# EAGLE design HLM1_Outsourced (EAGLE 8.4.1)
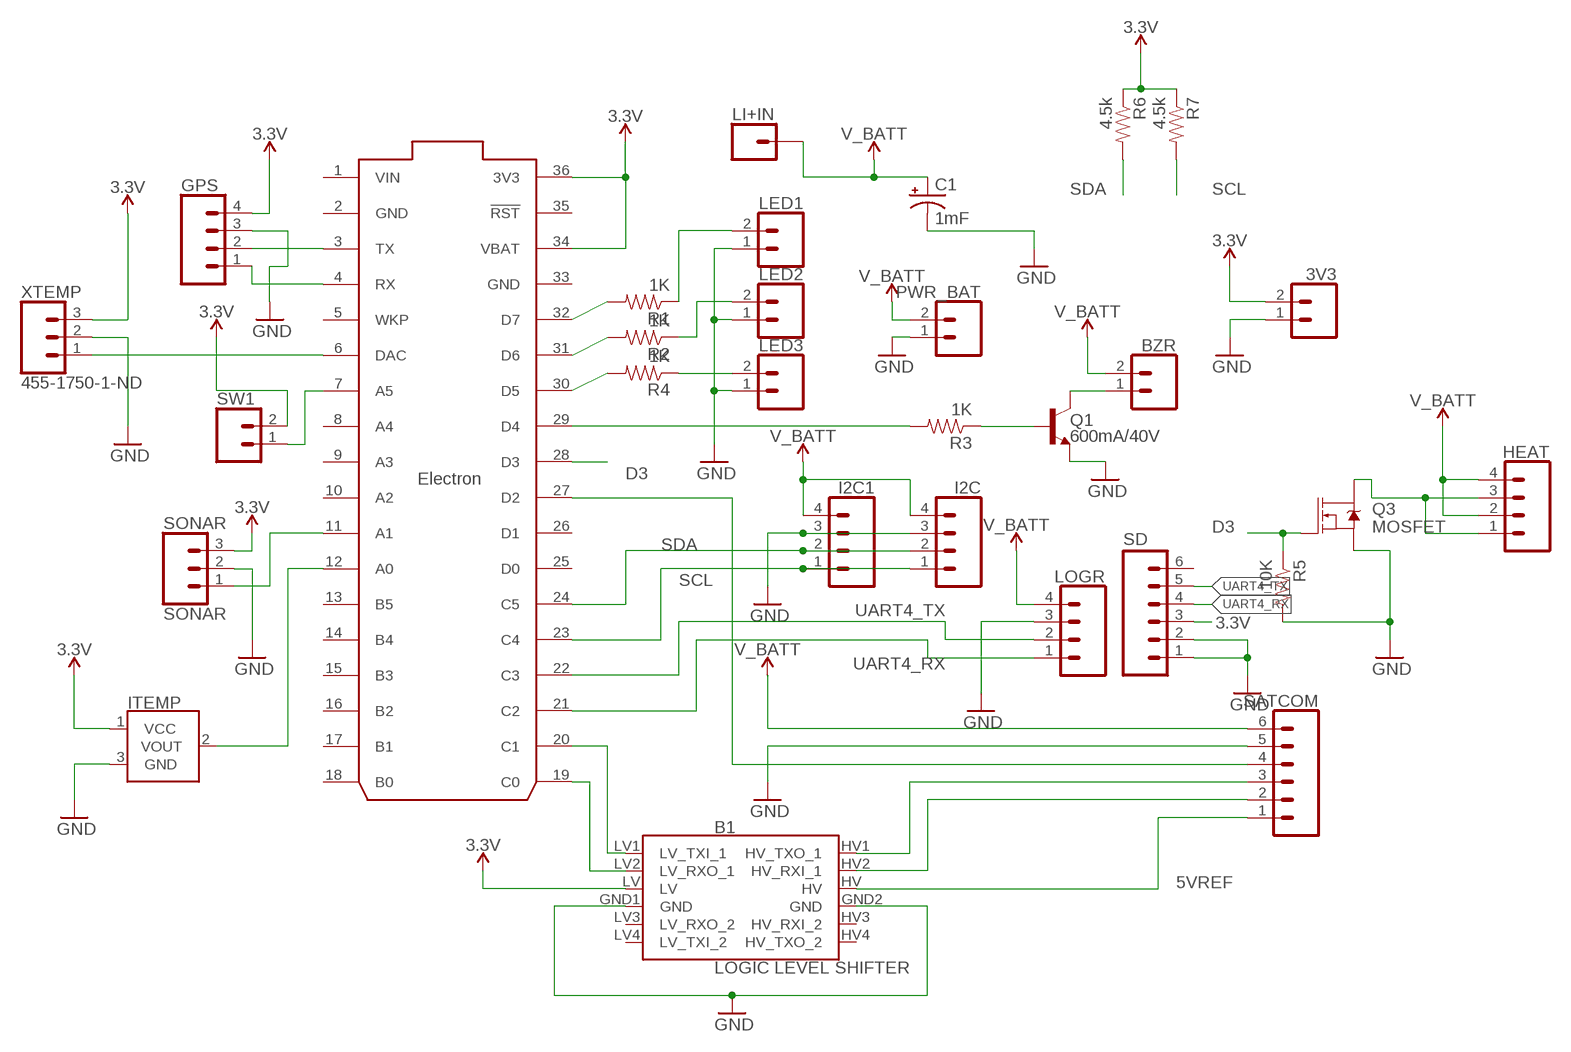
[diagram p0: schematic, sheet 1]

## Parts
3V3  CONN_02  [1X02]
B1  LOGIC LEVEL SHIFTER  SPARKFUN_LOGIC_LEVEL_CONVERTER  [SPARKFUN_LOGIC_LEVEL_CONVERTER]
BZR  CONN_02  [1X02]
C1  1mF  1000UF-RADIAL-5MM-25V-20%  [CPOL-RADIAL-5MM-10MM]
GPS  CONN_04  [1X04]
HEAT  CONN_04  [1X04]
I2C  CONN_04  [1X04]
I2C1  CONN_04  [1X04]
ITEMP  TMP36GT9  [TO-92]
LED1  CONN_02  [1X02]
LED2  CONN_02  [1X02]
LED3  CONN_02  [1X02]
LI+IN  CONN_01  [1X01]
LOGR  CONN_04  [1X04]
MCU  ELECTRON  ELECTRON_WITH_HEADERS  [ELECTRON]
PWR_BAT  CONN_02  [1X02]
Q1  600mA/40V  TRANS_NPN-P2N2222A  [TO-92]
Q3  MOSFET  MOSFET-NCH-FQP30N06L  [TO220V]
R1  1K  RESISTORPTH-1/6W  [1/6W-RES]
R2  1K  RESISTORPTH-1/6W  [1/6W-RES]
R3  1K  RESISTORPTH-1/6W  [1/6W-RES]
R4  1K  RESISTORPTH-1/6W  [1/6W-RES]
R5  10K  RESISTORPTH-1/6W  [1/6W-RES]
R6  4.5k  RESISTORPTH-1/6W  [1/6W-RES]
R7  4.5k  RESISTORPTH-1/6W  [1/6W-RES]
SATCOM  CONN_06SILK_FEMALE_PTH  [1X06@1]
SD  M06NO_SILK_FEMALE_PTH  [1X06_NO_SILK]
SONAR  SONAR  CONN_03  [1X03]
SW1  CONN_02  [1X02]
XTEMP  455-1750-1-ND  CONN_03  [1X03]

## Nets
3.3V: 3V3.2 B1.LV GPS.4 ITEMP.1(VCC) MCU.34(VBAT) MCU.36(3V3) R6.1 R7.1 SD.3 SONAR.3 SW1.2 XTEMP.3
5VREF: B1.HV SATCOM.1
D3: MCU.28(D3) Q3.1(G) R5.1
GND: 3V3.1 B1.GND1(GND) B1.GND2(GND) C1.- GPS.3 I2C1.3 I2C.3 ITEMP.3(GND) LED1.1 LED2.1 LED3.1 LOGR.3 PWR_BAT.1 Q1.3(E) Q3.3(S) R5.2 SATCOM.5 SD.1 SD.2 SONAR.2 XTEMP.2
IRWKP: MCU.27(D2) SATCOM.4
N$1: MCU.6(DAC) XTEMP.1
N$3: MCU.32(D7) R1.2
N$4: Q1.2(B) R3.1
N$5: MCU.29(D4) R3.2
N$6: B1.LV1(LV_TXI_1) MCU.20(C1)
N$7: B1.LV2(LV_RXO_1) MCU.19(C0)
N$8: LED1.2 R1.1
N$9: BZR.1 Q1.1(C)
N$10: B1.HV1(HV_TXO_1) SATCOM.3
N$11: HEAT.1 HEAT.3 Q3.2(D)
N$13: MCU.31(D6) R2.2
N$14: B1.HV2(HV_RXI_1) SATCOM.2
N$15: MCU.7(A5) SW1.1
N$16: LED2.2 R2.1
N$17: MCU.11(A1) SONAR.1
N$18: MCU.30(D5) R4.2
N$19: LED3.2 R4.1
N$21: ITEMP.2(VOUT) MCU.12(A0)
RX: GPS.1 MCU.4(RX)
SCL: I2C1.1 I2C.1 MCU.23(C4) R7.2
SDA: I2C1.2 I2C.2 MCU.24(C5) R6.2
TX: GPS.2 MCU.3(TX)
UART4_RX: LOGR.1 MCU.21(C2) SD.4
UART4_TX: LOGR.2 MCU.22(C3) SD.5
V_BATT: BZR.2 C1.+ HEAT.2 HEAT.4 I2C1.4 I2C.4 LI+IN.1 LOGR.4 PWR_BAT.2 SATCOM.6
Unconnected: B1.HV3(HV_RXI_2) B1.HV4(HV_TXO_2) B1.LV3(LV_RXO_2) B1.LV4(LV_TXI_2) MCU.5(WKP) MCU.8(A4) MCU.9(A3) MCU.10(A2) MCU.13(B5) MCU.14(B4) MCU.15(B3) MCU.16(B2) MCU.17(B1) MCU.18(B0) MCU.25(D0) MCU.26(D1) MCU.35(!RST) SD.6

## Power pins joined to a net without a drawn wire
GND: MCU.2(GND) MCU.33(GND)
VIN: MCU.1(VIN)

## Library data of the parts
3V3 BZR LED1-LED3 PWR_BAT SW1 = SparkFun-Connectors:CONN_02: Multi connection point. Often used as Generic Header-pin footprint for 0.1 inch spaced/style header connections On any of the 0.1 inch spaced packages, you can populate with these: Break Away Headers - Straight <https://www.sparkfun.com/products/116> (PRT-00116) Break Away Male Headers - Right Angle <https://www.sparkfun.com/products/553> (PRT-00553) Female Headers <https://www.sparkfun.com/products/115> (PRT-00115) Break Away Headers - Machine Pin <https://www.sparkfun.com/products/117> (PRT-00117) Break Away Female Headers - Swiss Machine Pin <https://www.sparkfun.com/products/743> (PRT-00743) For SCREWTERMINALS and SPRING TERMINALS visit here: Screw Terimnals on SparkFun.com <https://www.sparkfun.com/search/results?term=Screw+Terminals> (5mm/3.5mm/2.54mm spacing) This device is also useful as a general connection point to wire up your design to another part of your project. Our various solder wires solder well into these plated through hole pads. Hook-Up Wire - Assortment (Stranded, 22 AWG) <https://www.sparkfun.com/products/11375> (PRT-11375) Hook-Up Wire - Assortment (Solid Core, 22 AWG) <https://www.sparkfun.com/products/11367> (PRT-11367) View the entire wire category on our website here <https://www.sparkfun.com/categories/141> Special notes: Molex polarized connector foot print use with: PRT-08233 with associated crimp pins and housings. 2.54_SCREWTERM for use with PRT-10571. 3.5mm Screw Terminal footprints for PRT-08084 5mm Screw Terminal footprints for use with PRT-08432
B1 = SparkFun-Boards:SPARKFUN_LOGIC_LEVEL_CONVERTER: SparkFun Logic Level Converter -Bi-Directional This is the mechnical outline for the 3.3V - 5V bi directional logic level converter. *Note, the "LOCK" Package has the header pins staggered by an offset of 5 mils (off center line), so that when you slide a row of standard 0.1" headers into the PTH pads, it will hold position vertically. See the follwing turorial for more information on this type of special footprints: Sneaky Footprints <https://www.sparkfun.com/tutorials/114> SparkFun Products: SparkFun Logic Level Converter - Bi-Directional <https://www.sparkfun.com/products/12009>
C1 = SparkFun-Capacitors:1000UF: 1,000µF/1mF ceramic capacitors A capacitor is a passive two-terminal electrical component used to store electrical energy temporarily in an electric field. CAP-08070; PROD_ID: CAP-09538
GPS HEAT I2C I2C1 LOGR = SparkFun-Connectors:CONN_04: Multi connection point. Often used as Generic Header-pin footprint for 0.1 inch spaced/style header connections On any of the 0.1 inch spaced packages, you can populate with these: Break Away Headers - Straight <https://www.sparkfun.com/products/116> (PRT-00116) Break Away Male Headers - Right Angle <https://www.sparkfun.com/products/553> (PRT-00553) Female Headers <https://www.sparkfun.com/products/115> (PRT-00115) Break Away Headers - Machine Pin <https://www.sparkfun.com/products/117> (PRT-00117) Break Away Female Headers - Swiss Machine Pin <https://www.sparkfun.com/products/743> (PRT-00743) For SCREWTERMINALS and SPRING TERMINALS visit here: Screw Terimnals on SparkFun.com <https://www.sparkfun.com/search/results?term=Screw+Terminals> (5mm/3.5mm/2.54mm spacing) This device is also useful as a general connection point to wire up your design to another part of your project. Our various solder wires solder well into these plated through hole pads. Hook-Up Wire - Assortment (Stranded, 22 AWG) <https://www.sparkfun.com/products/11375> (PRT-11375) Hook-Up Wire - Assortment (Solid Core, 22 AWG) <https://www.sparkfun.com/products/11367> (PRT-11367) View the entire wire category on our website here <https://www.sparkfun.com/categories/141> Special notes: Molex polarized connector foot print use with SKU : PRT-08231 with associated crimp pins and housings. 1MM SMD Version SKU: PRT-10208; PROD_ID: CONN-09696
ITEMP = SparkFun-Sensors:TMP36: TMP36 Precision Analog °C Temperature Sensor The TMP36 is a low voltage, precision centigrade temperature sensor. It provides a voltage output that is linearly proportional to the Celsius temperature. It also doesn’t require any external calibration to provide typical accuracies of ±1°C at +25°C and ±2°C over the −40°C to +125°C temperature range. We like it because it’s so easy to use: Just give the device a ground and 2.7 to 5.5 VDC and read the voltage on the Vout pin. The output voltage can be converted to temperature easily using the scale factor of 10 mV/°C. Datasheet <http://cdn.sparkfun.com/datasheets/Sensors/Temp/TMP35_36_37.pdf> SparkFun Products Temperature Sensor - TMP36 <https://www.sparkfun.com/products/10988> (SEN-10988) SparkFun Danger Shield <https://www.sparkfun.com/products/11649> (DEV-11649); PROD_ID: IC-09880; SF_ID: SEN-10988
LI+IN = SparkFun-Connectors:CONN_01: Single connection point. Often used as Generic Header-pin footprint for 0.1 inch spaced/style header connections On any of the 0.1 inch spaced packages, you can populate with these: Break Away Headers - Straight <https://www.sparkfun.com/products/116> (PRT-00116) Break Away Male Headers - Right Angle <https://www.sparkfun.com/products/553> (PRT-00553) Female Headers <https://www.sparkfun.com/products/115> (PRT-00115) Break Away Headers - Machine Pin <https://www.sparkfun.com/products/117> (PRT-00117) Break Away Female Headers - Swiss Machine Pin <https://www.sparkfun.com/products/743> (PRT-00743) This device is also useful as a general connection point to wire up your design to another part of your project. Our various solder wires solder well into these plated through hole pads. Hook-Up Wire - Assortment (Stranded, 22 AWG) <https://www.sparkfun.com/products/11375> (PRT-11375) Hook-Up Wire - Assortment (Solid Core, 22 AWG) <https://www.sparkfun.com/products/11367> (PRT-11367) View the entire wire category on our website here <https://www.sparkfun.com/categories/141> Special notes: SMTSO-256-ET is a "flush mount" nut for a 4-40 screw. We mostly use this on specialty testbeds; it is a nice way to connect hardware to your PCB at an adjustable hieght. Also note, the SNAP packages are for using a snappable style connector. We sell a baggie of snaps and they are also used on two LilyPad designs: Snap Assortment - 30 pack (male and female) <https://www.sparkfun.com/products/11347> (DEV-11347) LilyPad Arduino SimpleSnap <https://www.sparkfun.com/products/10941> (DEV-10941) LilyPad SimpleSnap Protoboard <https://www.sparkfun.com/products/10940> (DEV-10940)
MCU = Particle-Devices:ELECTRON: Particle Electron footprint
Q1 = SparkFun-DiscreteSemi:TRANS_NPN: NPN transistor Current controlled devices typically used to amplify current or used as a switch. BC547 - COM-08928 <http://www.sparkfun.com/products/8928> (TO-92 45V 100mA) (1.Collector 2.Base 3.Emitter) 2N3904 - COM-00521 <http://www.sparkfun.com/products/521> (TO-92 40V 200mA) (1.Emitter 2.Base 3.Collector) P2N2222A - COM-12852 <http://www.sparkfun.com/products/12852> (TO-92 40V 600mA) (1.Collector 2.Base 3.Emitter); PROD_ID: TRANS-09536
Q3 = SparkFun-DiscreteSemi:MOSFET-NCH: N-channel MOSFETs Voltage controlled devices that allow control of high current outputs. SparkFun Products: SparkFun OpenScale <https://www.sparkfun.com/products/13261> SparkFun Digital Sandbox <https://www.sparkfun.com/products/12651> SparkFun Monster Moto Shield <https://www.sparkfun.com/products/10182> SparkFun MOSFET Power Controller <https://www.sparkfun.com/products/11214>; PROD_ID: TRANS-10060; VALUE: 60V/32A/35mΩ
R1-R7 = SparkFun-Passives:RESISTOR: Resistor Basic schematic elements and footprints for 0603, 1206, and PTH resistors.
SATCOM = SparkFun-Connectors:CONN_06: Multi connection point. Often used as Generic Header-pin footprint for 0.1 inch spaced/style header connections On any of the 0.1 inch spaced packages, you can populate with these: Break Away Headers - Straight <https://www.sparkfun.com/products/116> (PRT-00116) Break Away Male Headers - Right Angle <https://www.sparkfun.com/products/553> (PRT-00553) Female Headers <https://www.sparkfun.com/products/115> (PRT-00115) Break Away Headers - Machine Pin <https://www.sparkfun.com/products/117> (PRT-00117) Break Away Female Headers - Swiss Machine Pin <https://www.sparkfun.com/products/743> (PRT-00743) Arduino Stackable Header - 6 Pin <https://www.sparkfun.com/products/9280> (PRT-09280) For SCREWTERMINALS and SPRING TERMINALS visit here: Screw Terimnals on SparkFun.com <https://www.sparkfun.com/search/results?term=Screw+Terminals> (5mm/3.5mm/2.54mm spacing) This device is also useful as a general connection point to wire up your design to another part of your project. Our various solder wires solder well into these plated through hole pads. Hook-Up Wire - Assortment (Stranded, 22 AWG) <https://www.sparkfun.com/products/11375> (PRT-11375) Hook-Up Wire - Assortment (Solid Core, 22 AWG) <https://www.sparkfun.com/products/11367> (PRT-11367) View the entire wire category on our website here <https://www.sparkfun.com/categories/141>; PROD_ID: CONN-08437
SD = SparkFun-Connectors:M06: Header 6 Standard 6-pin 0.1" header. Use with straight break away headers (SKU : PRT-00116), right angle break away headers (PRT-00553), swiss pins (PRT-00743), machine pins (PRT-00117), and female headers (PRT-00115). Molex polarized connector foot print use with SKU : PRT-08094 with associated crimp pins and housings. NOTES ON THE VARIANTS LOCK and LOCK_LONGPADS... This footprint was designed to help hold the alignment of a through-hole component (i.e. 6-pin header) while soldering it into place. You may notice that each hole has been shifted either up or down by 0.005 of an inch from it's more standard position (which is a perfectly straight line). This slight alteration caused the pins (the squares in the middle) to touch the edges of the holes. Because they are alternating, it causes a "brace" to hold the component in place. 0.005 has proven to be the perfect amount of "off-center" position when using our standard breakaway headers. Although looks a little odd when you look at the bare footprint, once you have a header in there, the alteration is very hard to notice. Also,if you push a header all the way into place, it is covered up entirely on the bottom side. This idea of altering the position of holes to aid alignment will be further integrated into the Sparkfun Library for other footprints. It can help hold any component with 3 or more connection pins.; PROD_ID: CONN-08437
SONAR = SparkFun-Connectors:CONN_03: Multi connection point. Often used as Generic Header-pin footprint for 0.1 inch spaced/style header connections On any of the 0.1 inch spaced packages, you can populate with these: Break Away Headers - Straight <https://www.sparkfun.com/products/116> (PRT-00116) Break Away Male Headers - Right Angle <https://www.sparkfun.com/products/553> (PRT-00553) Female Headers <https://www.sparkfun.com/products/115> (PRT-00115) Break Away Headers - Machine Pin <https://www.sparkfun.com/products/117> (PRT-00117) Break Away Female Headers - Swiss Machine Pin <https://www.sparkfun.com/products/743> (PRT-00743) Stackable Header - 3 Pin (Female, 0.1") <https://www.sparkfun.com/products/13875> (PRT-13875) For SCREWTERMINALS and SPRING TERMINALS visit here: Screw Terimnals on SparkFun.com <https://www.sparkfun.com/search/results?term=Screw+Terminals> (5mm/3.5mm/2.54mm spacing) This device is also useful as a general connection point to wire up your design to another part of your project. Our various solder wires solder well into these plated through hole pads. Hook-Up Wire - Assortment (Stranded, 22 AWG) <https://www.sparkfun.com/products/11375> (PRT-11375) Hook-Up Wire - Assortment (Solid Core, 22 AWG) <https://www.sparkfun.com/products/11367> (PRT-11367) View the entire wire category on our website here <https://www.sparkfun.com/categories/141> Special notes: Molex polarized connector foot print use with SKU : PRT-08232 with associated crimp pins and housings.; PROD_ID: XXX-00000; VALUE: 455-1750-1-ND
XTEMP = SparkFun-Connectors:CONN_03: Multi connection point. Often used as Generic Header-pin footprint for 0.1 inch spaced/style header connections On any of the 0.1 inch spaced packages, you can populate with these: Break Away Headers - Straight <https://www.sparkfun.com/products/116> (PRT-00116) Break Away Male Headers - Right Angle <https://www.sparkfun.com/products/553> (PRT-00553) Female Headers <https://www.sparkfun.com/products/115> (PRT-00115) Break Away Headers - Machine Pin <https://www.sparkfun.com/products/117> (PRT-00117) Break Away Female Headers - Swiss Machine Pin <https://www.sparkfun.com/products/743> (PRT-00743) Stackable Header - 3 Pin (Female, 0.1") <https://www.sparkfun.com/products/13875> (PRT-13875) For SCREWTERMINALS and SPRING TERMINALS visit here: Screw Terimnals on SparkFun.com <https://www.sparkfun.com/search/results?term=Screw+Terminals> (5mm/3.5mm/2.54mm spacing) This device is also useful as a general connection point to wire up your design to another part of your project. Our various solder wires solder well into these plated through hole pads. Hook-Up Wire - Assortment (Stranded, 22 AWG) <https://www.sparkfun.com/products/11375> (PRT-11375) Hook-Up Wire - Assortment (Solid Core, 22 AWG) <https://www.sparkfun.com/products/11367> (PRT-11367) View the entire wire category on our website here <https://www.sparkfun.com/categories/141> Special notes: Molex polarized connector foot print use with SKU : PRT-08232 with associated crimp pins and housings.; PROD_ID: XXX-00000

## Net classes
0 default: width 0.178 mm
1 vcc: width 0.203 mm

## Board
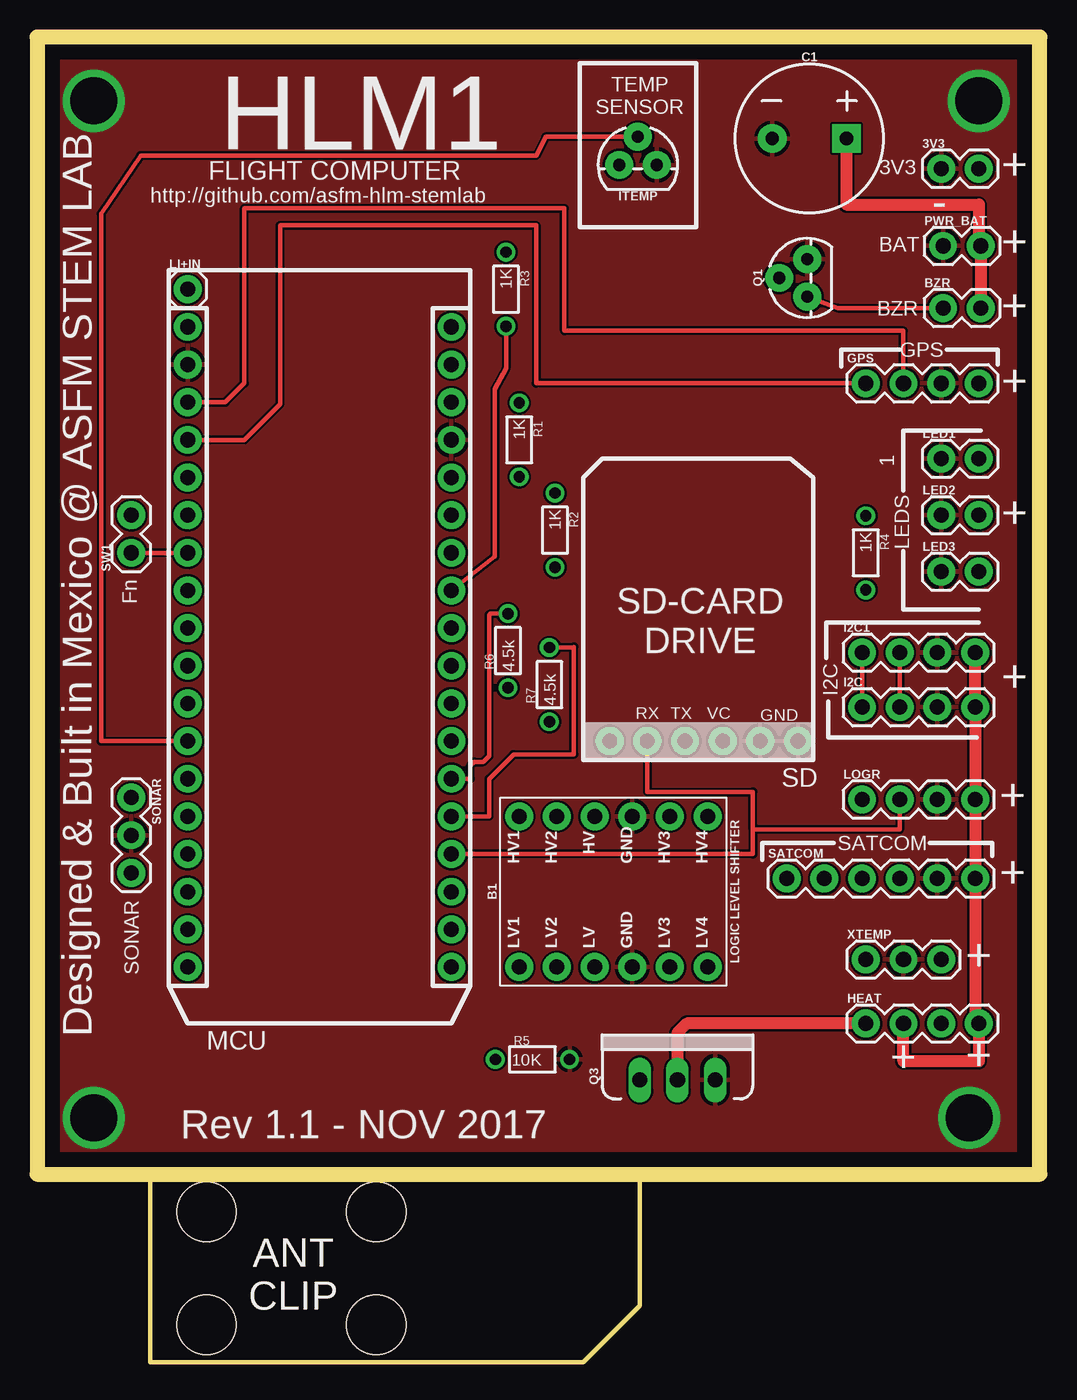
[diagram p1: board, top side]
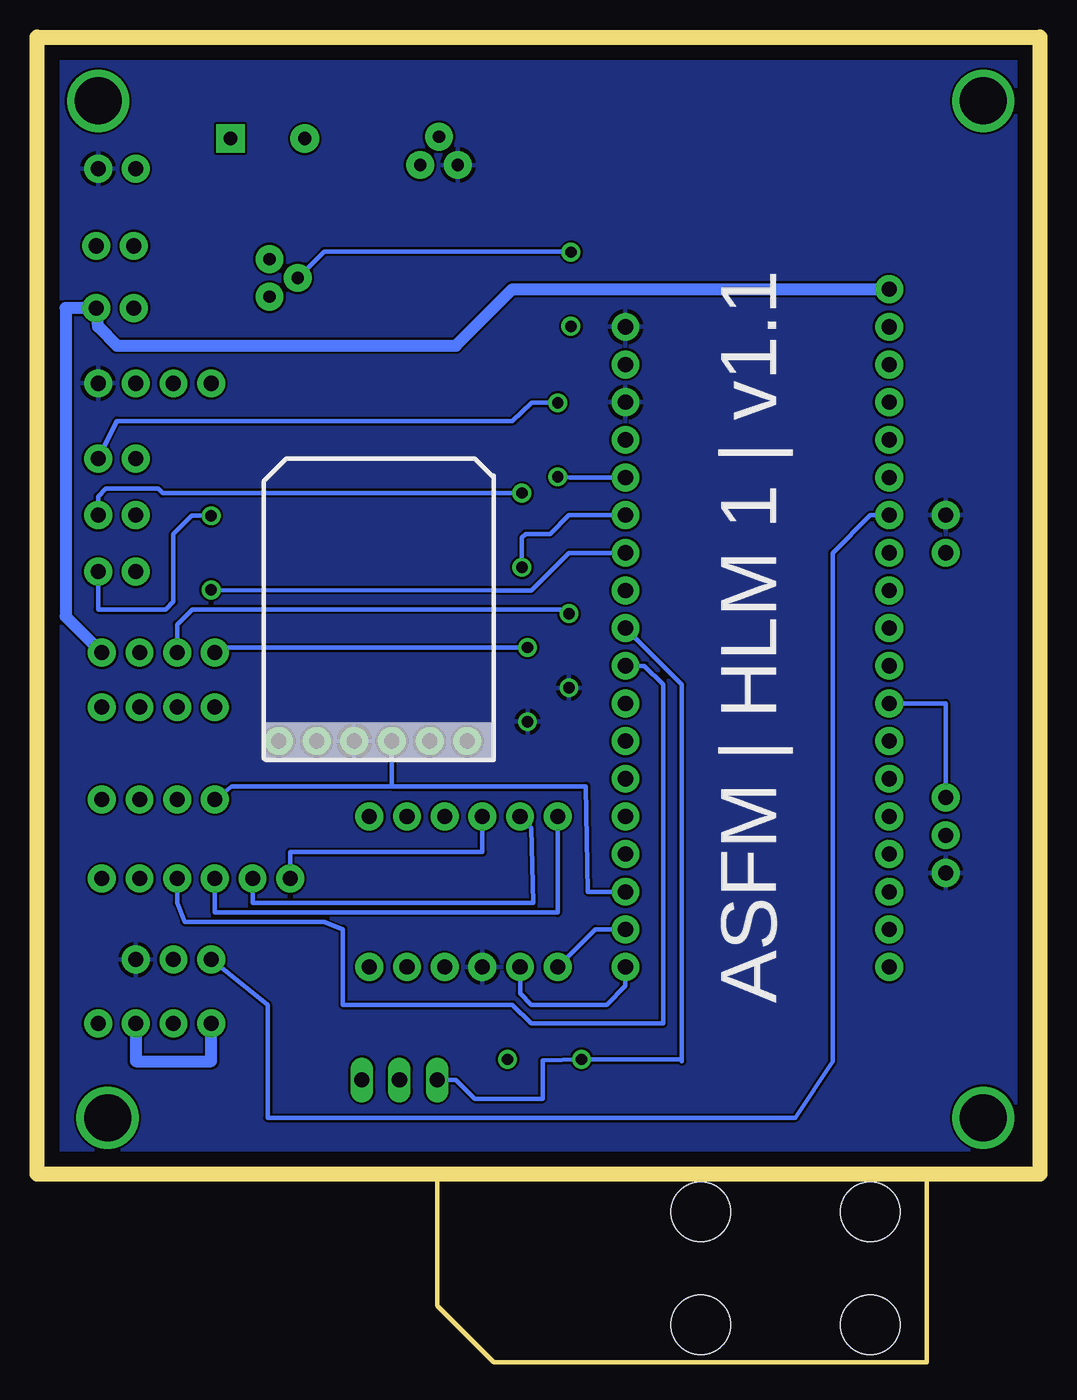
[diagram p2: board, bottom side, seen from below]

Size 67.61 x 89.4 mm. Coordinates in mm from the lower left corner, seen from the top.
Outline: 0,12.7 67.61,12.7 67.61,89.4 0,89.4 0,12.7
Copper layers (1*16): Top 0.035mm / dielectric 1.5mm / Bottom 0.035mm
Design rules "default": minimum track width 6mil, minimum drill 0.35mm, track to track 6mil, track to pad 6mil, pad to pad 6mil, via to via 6mil, smd to smd 6mil, copper to edge 40mil, drill to drill 6mil, minimum pad ring 10mil, minimum via ring 8mil, stop-mask expansion 4mil, vias tented up to drill 0mil, thermal gap 10mil
Holes 4 mm at 22.86,10.16 22.86,2.54 11.43,10.16 11.43,2.54

### Footprints (pad centres in the part's own frame; a part is rotated, then mirrored left to right if it is on the bottom)
1X02 = drill 1.016 pad 1.88: 1 0,0; 2 2.54,0
SPARKFUN_LOGIC_LEVEL_CONVERTER = drill 1.016 pad 1.88: GND1 -5.08,-1.27; GND2 5.08,-1.27; HV 5.08,1.27; HV1 5.08,6.35; HV2 5.08,3.81; HV3 5.08,-3.81; HV4 5.08,-6.35; LV -5.08,1.27; LV1 -5.08,6.35; LV2 -5.08,3.81; LV3 -5.08,-3.81; LV4 -5.08,-6.35
CPOL-RADIAL-5MM-10MM = drill 0.9 pad 1.93 square: + 2.5,0 | drill 0.9 pad 1.93: - -2.5,0
1X04 = drill 1.016 pad 1.88: 1 0,0; 2 2.54,0; 3 5.08,0; 4 7.62,0
TO-92 = drill 0.813 pad 1.88: 1 -1.27,0; 2 0,1.905; 3 1.27,0
1X01 = drill 1.016 pad 1.88: 1 0,0
ELECTRON = drill 1.016 pad 1.88: 1 1.27,46.99; 2 1.27,44.45; 3 1.27,41.91; 4 1.27,39.37; 5 1.27,36.83; 6 1.27,34.29; 7 1.27,31.75; 8 1.27,29.21; 9 1.27,26.67; 10 1.27,24.13; 11 1.27,21.59; 12 1.27,19.05; 13 1.27,16.51; 14 1.27,13.97; 15 1.27,11.43; 16 1.27,8.89; 17 1.27,6.35; 18 1.27,3.81; 19 19.05,3.81; 20 19.05,6.35; 21 19.05,8.89; 22 19.05,11.43; 23 19.05,13.97; 24 19.05,16.51; 25 19.05,19.05; 26 19.05,21.59; 27 19.05,24.13; 28 19.05,26.67; 29 19.05,29.21; 30 19.05,31.75; 31 19.05,34.29; 32 19.05,36.83; 33 19.05,39.37; 34 19.05,41.91; 35 19.05,44.45; 36 19.05,46.99
TO220V = drill 1.016 long: 1 -2.54,0; 2 0,0; 3 2.54,0
1/6W-RES = drill 0.762: 1 -2.5,0; 2 2.5,0
1X06@1 = drill 1.016 pad 1.88: 1 0,0; 2 2.54,0; 3 5.08,0; 4 7.62,0; 5 10.16,0; 6 12.7,0
1X06_NO_SILK = drill 1.016 pad 1.88: 1 0,0; 2 2.54,0; 3 5.08,0; 4 7.62,0; 5 10.16,0; 6 12.7,0
1X03 = drill 1.016 pad 1.88: 1 0,0; 2 2.54,0; 3 5.08,0

### Placement (x,y rotation side)
3V3  60.96,80.52 0 top
B1  38.86,31.75 90 top
BZR  61.09,71.12 0 top
C1  52.07,82.55 0 top
GPS  55.88,66.04 0 top
HEAT  55.88,22.86 0 top
I2C  55.63,44.2 0 top
I2C1  55.63,47.88 0 top
ITEMP  40.51,80.77 0 top
LED1  60.96,60.96 0 top
LED2  60.96,57.15 0 top
LED3  60.96,53.34 0 top
LI+IN  10.16,72.39 0 top
LOGR  55.63,37.97 0 top
MCU  8.89,22.86 0 top
PWR_BAT  61.09,75.31 0 top
Q1  51.94,73.15 90 top
Q3  43.18,19.05 0 top
R1  32.51,62.23 270 top
R2  34.93,56.13 270 top
R3  31.62,72.39 270 top
R4  55.88,54.61 270 top
R5  33.4,20.45 0 top
R6  31.75,48.01 90 top
R7  34.54,45.72 90 top
SATCOM  50.55,32.64 0 top
SD  51.31,41.91 180 top
SONAR  6.35,38.1 270 top
SW1  6.35,54.61 90 top
XTEMP  55.88,27.18 0 top

### Tracks (layer width: path | path; a pad name or v marks a point on that pad's centre or on a via)
3.3V
  pour Bottom: 0,91.44 69.85,91.44 69.85,2.54 0,2.54
5VREF
  Bottom 0.305: SATCOM.1 50.55,34.42 37.59,34.42 B1.HV
D3
  Bottom 0.305: Q3.1 39.37,19.05 38.1,17.78 33.53,17.78 33.53,20.36 R5.1 24.26,20.45 24.13,20.32 24.13,45.72 MCU.28
GND  (via drill 3.17)
  other vias: 3.81,85.09 63.5,85.09 62.87,16.51 3.81,16.51
  pour Top: 0,90.17 0,2.54 69.85,2.54 69.85,90.17
IRWKP
  Bottom 0.305: SATCOM.4 58.17,30.99 57.66,29.72 48.26,29.72 46.99,29.21 46.99,24.13 35.56,24.13 34.29,22.86 25.4,22.86 25.4,45.72 26.67,46.99 MCU.27
N$1
  Bottom 0.305: MCU.6 11.43,57.15 13.97,54.61 13.97,20.32 16.51,16.51 52.07,16.51 52.07,24.13 XTEMP.1
N$3
  Bottom 0.305: R1.2 31.71,59.69 MCU.32
N$4
  Bottom 0.305: 31.92,75.18 R3.1 31.66,74.93 48.26,74.93 Q1.2
N$5
  Top 0.305: R3.2 31.62,67.06 30.86,65.66 30.86,54.36 MCU.29
N$6
  Bottom 0.305: B1.LV1 29.97,29.21 MCU.20
N$7
  Bottom 0.305: B1.LV2 35.05,24.89 34.29,24.13 29.21,24.13 27.94,25.4 MCU.19
N$8
  Bottom 0.305: LED1.2 62.23,63.5 35.56,63.5 34.25,64.73 R1.1
N$9
  Top 0.305: BZR.1 53.98,71.12 Q1.1
N$10
  Bottom 0.305: SATCOM.3 55.63,30.35 32.51,30.35 B1.HV1
N$11
  Top 0.813: HEAT.1 43.82,22.86 43.18,22.23 Q3.2
  Bottom 0.813: HEAT.3 60.96,20.32 55.88,20.32 HEAT.1
N$13
  Bottom 0.305: MCU.31 31.75,57.15 33.02,55.88 34.67,55.88 34.93,55.63 R2.2
N$14
  Bottom 0.305: B1.HV2 34.29,36.07 34.16,30.99 53.09,30.99 SATCOM.2
N$15
  Top 0.305: MCU.7 SW1.1
N$16
  Bottom 0.305: R2.1 59.14,58.63 59.44,58.93 62.99,58.93 63.5,58.42 LED2.2
N$17
  Bottom 0.305: MCU.11 6.35,44.45 SONAR.1
N$18
  Bottom 0.305: MCU.30 31.75,54.61 34.29,52.07 36.79,52.07 R4.2
N$19
  Bottom 0.305: LED3.2 63.5,50.8 58.93,50.8 58.42,51.31 58.42,55.88 57.19,57.11 R4.1
N$21
  Top 0.305: ITEMP.2 34.29,82.68 33.66,81.41 6.98,81.41 4.32,77.47 4.32,41.91 MCU.12
RX
  Top 0.305: GPS.1 33.66,66.04 33.66,76.71 16.38,76.71 16.38,64.64 13.97,62.23 MCU.4 10.29,62.36
SCL
  Top 0.305: I2C.1 I2C1.1 55.25,48.26 | MCU.23 30.48,36.83 30.48,39.37 32.13,41.02 36.2,41.02 36.2,48.26 | 36.2,48.26 36.16,48.22 | 36.2,48.26 36.16,48.22 | 36.16,48.22 R7.2
  Bottom 0.305: I2C1.1 55.29,48.22 R7.2
SDA
  Top 0.305: I2C1.2 I2C.2 | MCU.24 29.21,39.37 29.21,40.26 29.46,40.51 30.1,40.51 30.48,40.89 30.48,50.42 30.57,50.51 R6.2
  Bottom 0.305: R6.2 32.04,50.8 57.15,50.8 58.17,49.78 I2C1.2
TX
  Top 0.305: GPS.2 58.42,69.6 35.56,69.6 35.56,77.85 13.97,77.85 13.97,66.04 12.7,64.77 MCU.3
UART4_RX
  Bottom 0.305: LOGR.1 54.48,38.86 43.69,38.86 | 43.69,38.86 30.61,38.86 30.48,31.75 MCU.21 | SD.4 43.69,38.86
UART4_TX
  Top 0.305: 48.26,35.94 48.26,38.48 41.15,38.48 SD.5 | 48.26,35.94 48.26,34.29 MCU.22 | LOGR.2 58.17,35.94 48.26,35.94
V_BATT
  Top 0.813: C1.+ 54.57,78.11 63.5,78.11 63.5,74.93 PWR_BAT.2 BZR.2 | I2C1.4 I2C.4 LOGR.4 SATCOM.6 63.25,23.11 HEAT.4 63.5,20.32 58.42,20.32 HEAT.2
  Bottom 0.813: LI+IN.1 35.56,72.39 39.37,68.58 62.23,68.58 63.5,69.85 BZR.2 65.69,71.12 65.69,50.33 I2C1.4

### Text on the board
tPlace: TEMP / SENSOR | HLM1 | FLIGHT COMPUTER | 3V3 | + | http://github.com/asfm-hlm-stemlab | - | BAT | + | BZR | + | GPS | + | 1 | + | LEDS | Fn | SD-CARD / DRIVE | I2C | + | RX | TX | VC | GND | + | SATCOM | + | + | SONAR | Designed & Built in Mexico @ ASFM STEM LAB | + | + | Rev 1.1 - NOV 2017 | ANT / CLIP
bPlace: ASFM | HLM 1 | v1.1